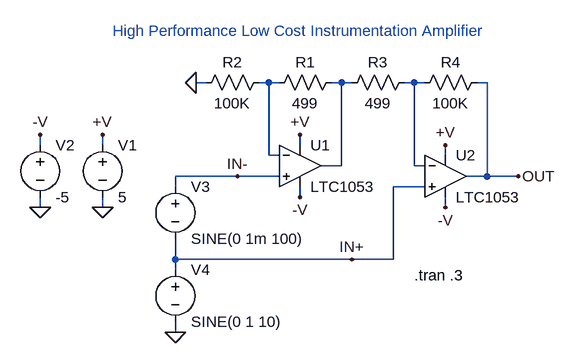
[diagram p0: schematic 1053.asc]
1053.asc, the LTspice schematic file:
Version 4
SHEET 1 896 680
WIRE 64 112 48 112
WIRE 160 112 144 112
WIRE 176 112 160 112
WIRE 272 112 256 112
WIRE 288 112 272 112
WIRE 384 112 368 112
WIRE 400 112 384 112
WIRE 496 112 480 112
WIRE -192 208 -192 192
WIRE -96 208 -96 192
WIRE 208 208 208 192
WIRE 160 224 160 112
WIRE 176 224 160 224
WIRE 432 224 432 208
WIRE 272 240 272 112
WIRE 272 240 240 240
WIRE 384 240 384 112
WIRE 400 240 384 240
WIRE 112 256 16 256
WIRE 176 256 112 256
WIRE 496 256 496 112
WIRE 496 256 464 256
WIRE 544 256 496 256
WIRE 16 272 16 256
WIRE 400 272 352 272
WIRE 208 288 208 272
WIRE -192 304 -192 288
WIRE -96 304 -96 288
WIRE 432 304 432 288
WIRE 16 384 16 352
WIRE 288 384 16 384
WIRE 352 384 352 272
WIRE 352 384 288 384
WIRE 16 400 16 384
WIRE 16 496 16 480
FLAG -96 304 0
FLAG 208 192 +V
FLAG -96 192 +V
FLAG 208 288 -V
FLAG -192 304 0
FLAG -192 192 -V
FLAG 48 112 0
FLAG 16 496 0
FLAG 432 208 +V
FLAG 432 304 -V
FLAG 544 256 OUT
FLAG 112 256 IN-
FLAG 288 384 IN+
SYMBOL voltage -96 192 R0
SYMATTR InstName V1
SYMATTR Value 5
SYMBOL voltage -192 192 R0
SYMATTR InstName V2
SYMATTR Value -5
SYMBOL res 272 96 R90
WINDOW 0 0 56 VBottom 2
WINDOW 3 32 56 VTop 2
SYMATTR InstName R1
SYMATTR Value 499
SYMBOL res 160 96 R90
WINDOW 0 0 56 VBottom 2
WINDOW 3 32 56 VTop 2
SYMATTR InstName R2
SYMATTR Value 100K
SYMBOL voltage 16 256 R0
SYMATTR InstName V3
SYMATTR Value SINE(0 1m 100)
SYMBOL opamps\\LTC1053 208 176 R0
SYMATTR InstName U1
SYMBOL res 384 96 R90
WINDOW 0 0 56 VBottom 2
WINDOW 3 32 56 VTop 2
SYMATTR InstName R3
SYMATTR Value 499
SYMBOL res 496 96 R90
WINDOW 0 0 56 VBottom 2
WINDOW 3 32 56 VTop 2
SYMATTR InstName R4
SYMATTR Value 100K
SYMBOL opamps\\LTC1053 432 192 R0
SYMATTR InstName U2
SYMBOL voltage 16 384 R0
SYMATTR InstName V4
SYMATTR Value SINE(0 1 10)
TEXT 384 408 Left 2 !.tran .3
TEXT 208 48 Bottom 2 ;High Performance Low Cost Instrumentation Amplifier

The netlist it stands for:
* 1053.asc
V1 +V 0 5
V2 -V 0 -5
R1 N002 N001 499
R2 N001 0 100K
V3 IN- IN+ SINE(0 1m 100)
XU1 IN- N001 +V -V N002 LTC1053  ; pins In+ In- V+ V- OUT
R3 N003 N002 499
R4 OUT N003 100K
XU2 IN+ N003 +V -V OUT LTC1053  ; pins In+ In- V+ V- OUT
V4 IN+ 0 SINE(0 1 10)
.tran .3
* High Performance Low Cost Instrumentation Amplifier
.backanno
.end